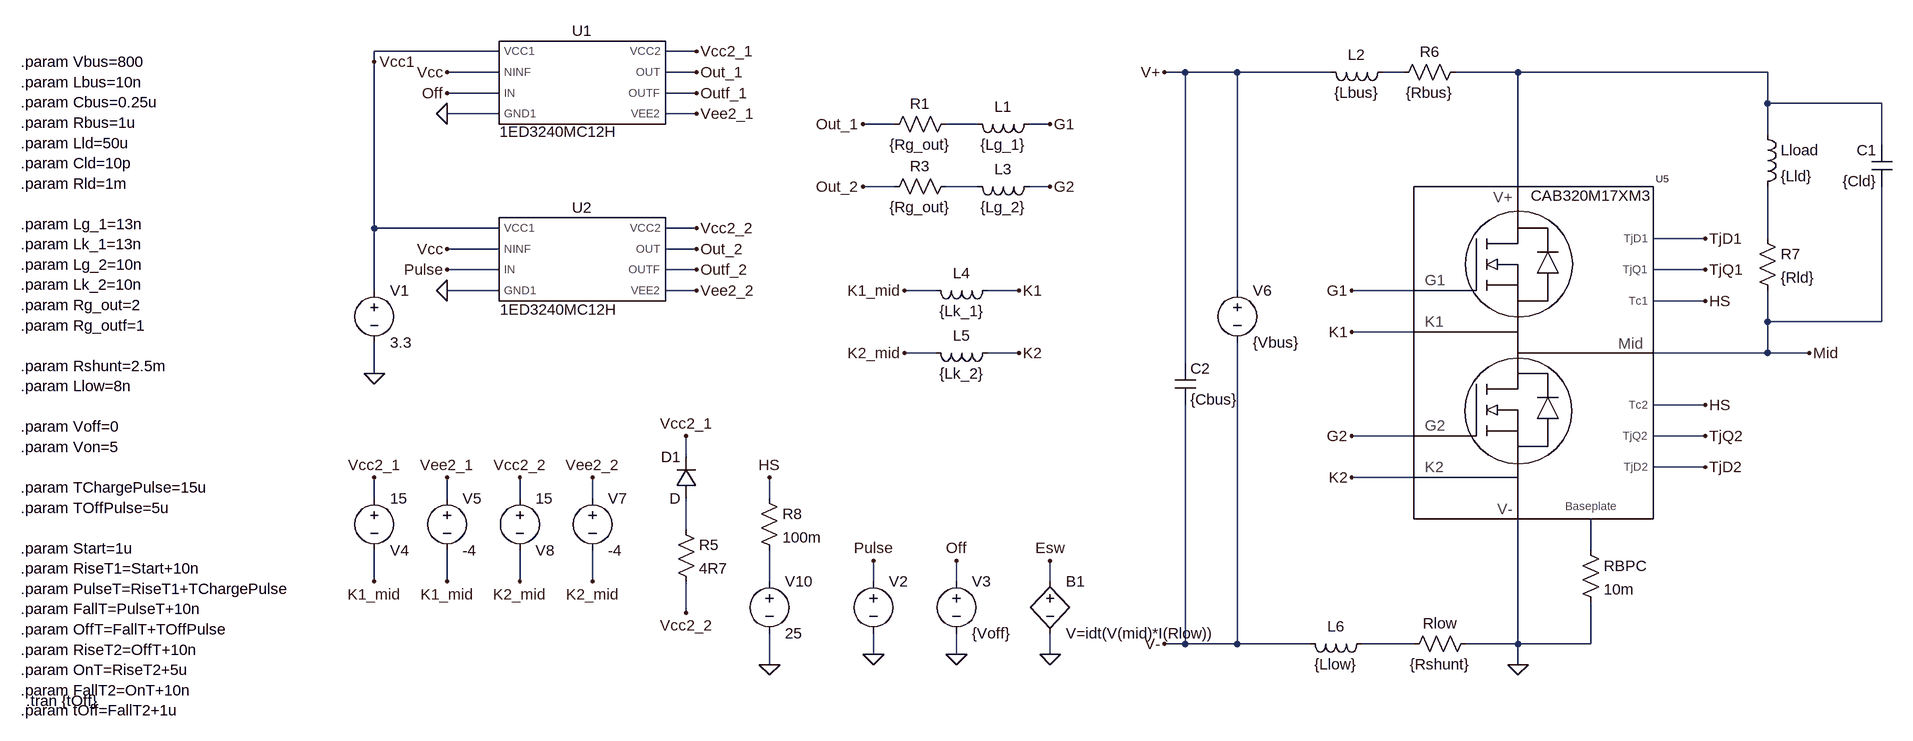
[diagram p0: schematic DPT_HB_Low.asc]
DPT_HB_Low.asc, the LTspice schematic file:
Version 4.1
SHEET 1 2660 1484
WIRE -48 -16 -240 -16
WIRE 256 -16 208 -16
WIRE -240 0 -240 -16
WIRE -48 16 -128 16
WIRE 256 16 208 16
WIRE 1008 16 976 16
WIRE 1088 16 1008 16
WIRE 1232 16 1088 16
WIRE 1344 16 1312 16
WIRE 1520 16 1424 16
WIRE 1904 16 1520 16
WIRE -48 48 -128 48
WIRE 256 48 208 48
WIRE 1904 64 1904 16
WIRE 2080 64 1904 64
WIRE -48 80 -128 80
WIRE 256 80 208 80
WIRE 560 96 512 96
WIRE 688 96 640 96
WIRE 800 96 768 96
WIRE 1904 112 1904 64
WIRE 2080 128 2080 64
WIRE 560 192 512 192
WIRE 688 192 640 192
WIRE 800 192 768 192
WIRE 1520 192 1520 16
WIRE -240 256 -240 0
WIRE -48 256 -240 256
WIRE 256 256 208 256
WIRE 1808 272 1728 272
WIRE 1904 272 1904 192
WIRE -48 288 -128 288
WIRE 256 288 208 288
WIRE -48 320 -128 320
WIRE 256 320 208 320
WIRE 1808 320 1728 320
WIRE -240 352 -240 256
WIRE -48 352 -128 352
WIRE 256 352 208 352
WIRE 624 352 576 352
WIRE 752 352 704 352
WIRE 1088 352 1088 16
WIRE 1360 352 1264 352
WIRE 1808 368 1728 368
WIRE 1904 400 1904 352
WIRE 2080 400 2080 192
WIRE 2080 400 1904 400
WIRE 1360 416 1264 416
WIRE 624 448 576 448
WIRE 752 448 704 448
WIRE 1904 448 1904 400
WIRE 1904 448 1728 448
WIRE 1968 448 1904 448
WIRE 1008 464 1008 16
WIRE -240 480 -240 432
WIRE 1808 528 1728 528
WIRE 1360 576 1264 576
WIRE 1808 576 1728 576
WIRE 240 608 240 576
WIRE 1808 624 1728 624
WIRE 1360 640 1264 640
WIRE -240 672 -240 640
WIRE -128 672 -128 640
WIRE -16 672 -16 640
WIRE 96 672 96 640
WIRE 368 672 368 640
WIRE 240 720 240 672
WIRE 1632 752 1632 704
WIRE -240 800 -240 752
WIRE -128 800 -128 752
WIRE -16 800 -16 752
WIRE 96 800 96 752
WIRE 368 800 368 752
WIRE 528 800 528 768
WIRE 656 800 656 768
WIRE 800 800 800 768
WIRE 240 848 240 800
WIRE 1008 896 1008 528
WIRE 1008 896 976 896
WIRE 1088 896 1088 432
WIRE 1088 896 1008 896
WIRE 1200 896 1088 896
WIRE 1360 896 1280 896
WIRE 1520 896 1520 704
WIRE 1520 896 1440 896
WIRE 1632 896 1632 832
WIRE 1632 896 1520 896
WIRE 528 912 528 880
WIRE 656 912 656 880
WIRE 800 912 800 880
WIRE 368 928 368 880
WIRE 1520 928 1520 896
FLAG -240 480 0
FLAG 1520 928 0
FLAG 368 928 0
FLAG 368 640 HS
FLAG 1808 368 HS
FLAG 1808 528 HS
FLAG 1808 272 TjD1
FLAG 1808 320 TjQ1
FLAG 1808 576 TjQ2
FLAG 1808 624 TjD2
FLAG 528 912 0
FLAG 656 912 0
FLAG 1968 448 Mid
FLAG -128 80 0
FLAG 800 192 G2
FLAG 1264 576 G2
FLAG 656 768 Off
FLAG 528 768 Pulse
FLAG -240 0 Vcc1
FLAG 256 -16 Vcc2_1
FLAG 256 256 Vcc2_2
FLAG -240 640 Vcc2_1
FLAG -128 640 Vee2_1
FLAG 256 352 Vee2_2
FLAG -128 800 K1_mid
FLAG -240 800 K1_mid
FLAG 96 640 Vee2_2
FLAG 96 800 K2_mid
FLAG -16 640 Vcc2_2
FLAG -16 800 K2_mid
FLAG -128 16 Vcc
FLAG -128 288 Vcc
FLAG 976 16 V+
FLAG 976 896 V-
FLAG 1264 640 K2
FLAG 256 80 Vee2_1
FLAG 1264 416 K1
FLAG 800 96 G1
FLAG 1264 352 G1
FLAG 512 96 Out_1
FLAG 256 16 Out_1
FLAG 256 48 Outf_1
FLAG 256 288 Out_2
FLAG 512 192 Out_2
FLAG 256 320 Outf_2
FLAG 240 576 Vcc2_1
FLAG 240 848 Vcc2_2
FLAG -128 352 0
FLAG -128 48 Off
FLAG -128 320 Pulse
FLAG 752 352 K1
FLAG 752 448 K2
FLAG 576 352 K1_mid
FLAG 576 448 K2_mid
FLAG 800 912 0
FLAG 800 768 Esw
SYMBOL voltage -240 336 R0
WINDOW 123 0 0 Left 0
WINDOW 39 0 0 Left 0
SYMATTR InstName V1
SYMATTR Value 3.3
SYMBOL voltage 528 784 R0
WINDOW 3 24 44 Invisible 2
WINDOW 123 0 0 Left 0
WINDOW 39 0 0 Left 0
SYMATTR Value PWL(0u {Voff} {Start} {Voff} {RiseT1} {Von} {PulseT} {Von} {FallT} {Voff} {offT} {Voff} {RiseT2} {Von} {OnT} {Von} {FallT2} {Voff})
SYMATTR InstName V2
SYMBOL voltage -240 656 R0
WINDOW 0 24 96 Left 2
WINDOW 3 24 16 Left 2
WINDOW 123 0 0 Left 0
WINDOW 39 0 0 Left 0
SYMATTR InstName V4
SYMATTR Value 15
SYMBOL voltage 1088 336 R0
WINDOW 123 0 0 Left 0
WINDOW 39 24 124 Left 2
SYMATTR InstName V6
SYMATTR Value {Vbus}
SYMBOL ind 1888 96 R0
SYMATTR InstName Lload
SYMATTR Value {Lld}
SYMBOL voltage 368 784 R0
WINDOW 123 0 0 Left 0
WINDOW 39 24 124 Left 2
SYMATTR InstName V10
SYMATTR Value 25
SYMBOL ind 1328 0 R90
WINDOW 0 5 56 VBottom 2
WINDOW 3 32 56 VTop 2
SYMATTR InstName L2
SYMATTR Value {Lbus}
SYMBOL CAB320M17XM3_LTspice 1376 704 R0
SYMATTR InstName U5
SYMBOL res 1616 736 R0
SYMATTR InstName RBPC
SYMATTR Value 10m
SYMBOL res 1456 880 R90
WINDOW 0 0 56 VBottom 2
WINDOW 3 32 56 VTop 2
SYMATTR InstName Rlow
SYMATTR Value {Rshunt}
SYMBOL 1ED3240MC12H -48 -32 R0
WINDOW 3 92 155 Bottom 2
SYMATTR InstName U1
SYMBOL 1ED3240MC12H -48 240 R0
WINDOW 3 93 157 Bottom 2
SYMATTR InstName U2
SYMBOL voltage 656 784 R0
WINDOW 123 0 0 Left 0
WINDOW 39 0 0 Left 0
SYMATTR InstName V3
SYMATTR Value {Voff}
SYMBOL res 656 80 R90
WINDOW 0 0 56 VBottom 2
WINDOW 3 32 56 VTop 2
SYMATTR InstName R1
SYMATTR Value {Rg_out}
SYMBOL res 656 176 R90
WINDOW 0 0 56 VBottom 2
WINDOW 3 32 56 VTop 2
SYMATTR InstName R3
SYMATTR Value {Rg_out}
SYMBOL voltage -128 656 R0
WINDOW 123 0 0 Left 0
WINDOW 39 0 0 Left 0
SYMATTR InstName V5
SYMATTR Value -4
SYMBOL voltage 96 656 R0
WINDOW 123 0 0 Left 0
WINDOW 39 0 0 Left 0
SYMATTR InstName V7
SYMATTR Value -4
SYMBOL voltage -16 656 R0
WINDOW 0 24 96 Left 2
WINDOW 3 24 16 Left 2
WINDOW 123 0 0 Left 0
WINDOW 39 0 0 Left 0
SYMATTR InstName V8
SYMATTR Value 15
SYMBOL diode 256 672 R180
WINDOW 0 24 64 Left 2
WINDOW 3 24 0 Left 2
SYMATTR InstName D1
SYMBOL res 224 704 R0
SYMATTR InstName R5
SYMATTR Value 4R7
SYMBOL ind 784 80 R90
WINDOW 0 5 56 VBottom 2
WINDOW 3 32 56 VTop 2
SYMATTR InstName L1
SYMATTR Value {Lg_1}
SYMBOL ind 784 176 R90
WINDOW 0 5 56 VBottom 2
WINDOW 3 32 56 VTop 2
SYMATTR InstName L3
SYMATTR Value {Lg_2}
SYMBOL ind 720 336 R90
WINDOW 0 5 56 VBottom 2
WINDOW 3 32 56 VTop 2
SYMATTR InstName L4
SYMATTR Value {Lk_1}
SYMBOL ind 720 432 R90
WINDOW 0 5 56 VBottom 2
WINDOW 3 32 56 VTop 2
SYMATTR InstName L5
SYMATTR Value {Lk_2}
SYMBOL res 1440 0 R90
WINDOW 0 0 56 VBottom 2
WINDOW 3 32 56 VTop 2
SYMATTR InstName R6
SYMATTR Value {Rbus}
SYMBOL cap 2096 192 R180
WINDOW 0 24 56 Left 2
WINDOW 3 24 8 Left 2
SYMATTR InstName C1
SYMATTR Value {Cld}
SYMBOL cap 992 464 R0
SYMATTR InstName C2
SYMATTR Value {Cbus}
SYMBOL res 1888 256 R0
SYMATTR InstName R7
SYMATTR Value {Rld}
SYMBOL res 352 656 R0
SYMATTR InstName R8
SYMATTR Value 100m
SYMBOL bv 800 784 R0
SYMATTR InstName B1
SYMATTR Value V=idt(V(mid)*I(Rlow))
SYMBOL ind 1296 880 R90
WINDOW 0 5 56 VBottom 2
WINDOW 3 32 56 VTop 2
SYMATTR InstName L6
SYMATTR Value {Llow}
TEXT -784 0 Left 2 !.param Vbus=800\n.param Lbus=10n\n.param Cbus=0.25u\n.param Rbus=1u\n.param Lld=50u\n.param Cld=10p\n.param Rld=1m\n \n.param Lg_1=13n\n.param Lk_1=13n\n.param Lg_2=10n\n.param Lk_2=10n\n.param Rg_out=2\n.param Rg_outf=1\n \n.param Rshunt=2.5m\n.param Llow=8n\n \n.param Voff=0\n.param Von=5\n \n.param TChargePulse=15u\n.param TOffPulse=5u\n \n.param Start=1u\n.param RiseT1=Start+10n\n.param PulseT=RiseT1+TChargePulse\n.param FallT=PulseT+10n \n.param OffT=FallT+TOffPulse\n.param RiseT2=OffT+10n \n.param OnT=RiseT2+5u\n.param FallT2=OnT+10n\n.param tOff=FallT2+1u
TEXT -776 984 Left 2 !.tran {tOff}

The netlist it stands for:
* DPT_HB_Low.asc
V1 Vcc1 0 3.3
V2 Pulse 0 PWL(0u {Voff} {Start} {Voff} {RiseT1} {Von} {PulseT} {Von} {FallT} {Voff} {offT} {Voff} {RiseT2} {Von} {OnT} {Von} {FallT2} {Voff})
V4 Vcc2_1 K1_mid 15
V6 V+ V- {Vbus}
Lload N002 N005 {Lld}
V10 N008 0 25
L2 N001 V+ {Lbus}
X§U5 N002 Mid 0 G1 K1 G2 K2 HS HS TjQ1 TjQ2 TjD1 TjD2 N007 CAB320M17XM3 Thermals=1 BPC=0 level=3 Rp=100  ; pins V+ Mid V- G1 K1 G2 K2 Tc1 Tc2 TjQ1 TjQ2 TjD1 TjD2 Baseplate
RBPC N007 0 10m
Rlow 0 N009 {Rshunt}
X§U1 Vcc1 Vcc Off 0 Vcc2_1 Out_1 Outf_1 Vee2_1 1ED3240MC12H  ; pins VCC1 NINF IN GND1 VCC2 OUT OUTF VEE2
X§U2 Vcc1 Vcc Pulse 0 Vcc2_2 Out_2 Outf_2 Vee2_2 1ED3240MC12H  ; pins VCC1 NINF IN GND1 VCC2 OUT OUTF VEE2
V3 Off 0 {Voff}
R1 N003 Out_1 {Rg_out}
R3 N004 Out_2 {Rg_out}
V5 Vee2_1 K1_mid -4
V7 Vee2_2 K2_mid -4
V8 Vcc2_2 K2_mid 15
D1 N006 Vcc2_1 D
R5 N006 Vcc2_2 4R7
L1 G1 N003 {Lg_1}
L3 G2 N004 {Lg_2}
L4 K1 K1_mid {Lk_1}
L5 K2 K2_mid {Lk_2}
R6 N002 N001 {Rbus}
C1 Mid N002 {Cld}
C2 V+ V- {Cbus}
R7 N005 Mid {Rld}
R8 HS N008 100m
B1 Esw 0 V=idt(V(mid)*I(Rlow))
L6 N009 V- {Llow}
.model D D
.lib standard.dio
.param Vbus=800
.param Lbus=10n
.param Cbus=0.25u
.param Rbus=1u
.param Lld=50u
.param Cld=10p
.param Rld=1m
.param Lg_1=13n
.param Lk_1=13n
.param Lg_2=10n
.param Lk_2=10n
.param Rg_out=2
.param Rg_outf=1
.param Rshunt=2.5m
.param Llow=8n
.param Voff=0
.param Von=5
.param TChargePulse=15u
.param TOffPulse=5u
.param Start=1u
.param RiseT1=Start+10n
.param PulseT=RiseT1+TChargePulse
.param FallT=PulseT+10n
.param OffT=FallT+TOffPulse
.param RiseT2=OffT+10n
.param OnT=RiseT2+5u
.param FallT2=OnT+10n
.param tOff=FallT2+1u
.tran {tOff}
.lib WS_HalfBridge.lib
.lib 1ED3240MC12H.lib
.backanno
.end